# Altium schematic sheet 6502-Debugger_2020-04-26_19-41-25.schdoc
size 223 x 147 mm
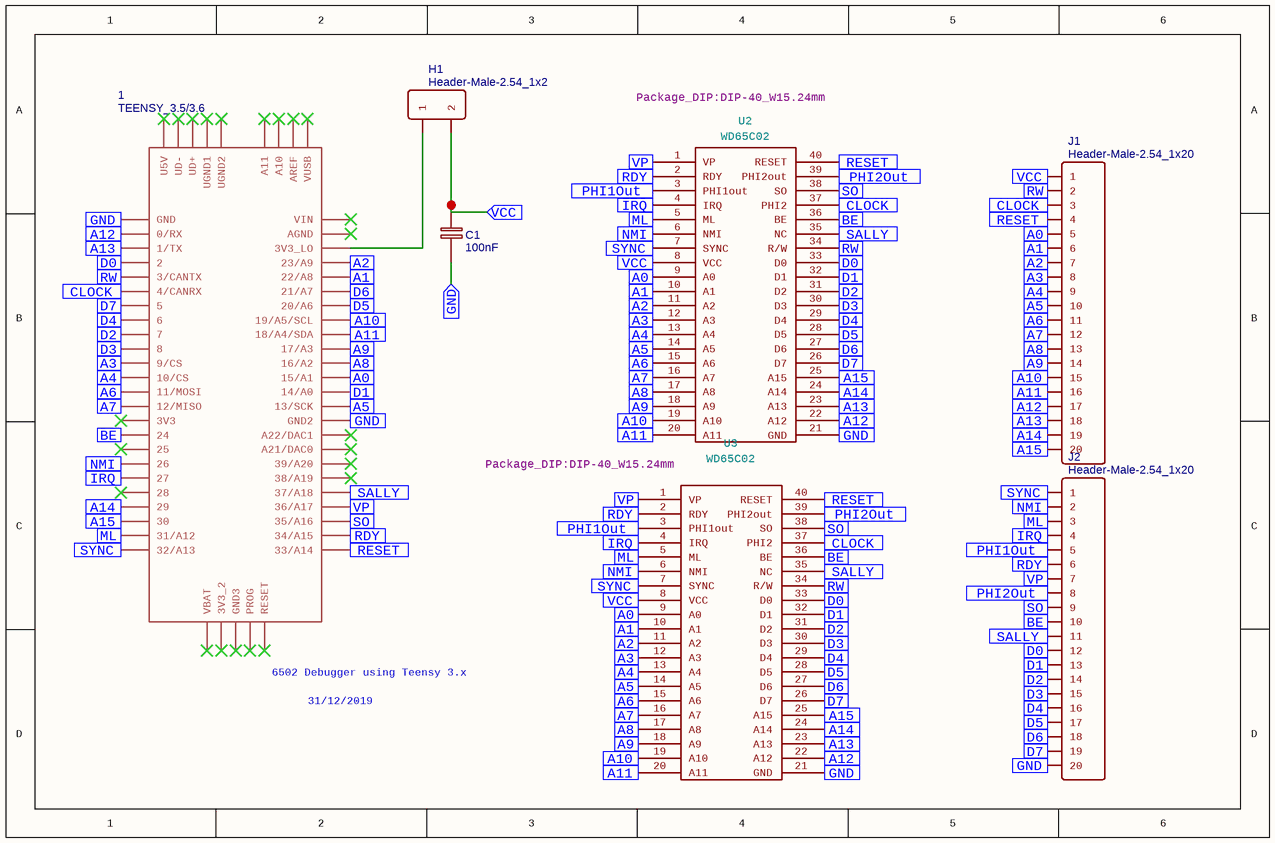
[diagram p0: 6502-Debugger_2020-04-26_19-41-25.schdoc]

## Parts
1  TEENSY_3.5/3.6  [TEENSY_3.5/3.6]
C1  100nF  [RAD-0.1]
H1  Header-Male-2.54_1x2  [HDR-2X1/2.54]
J1  Header-Male-2.54_1x20  [HDR-TH_20PIN-V-MALE-PITCH2.54]
J2  Header-Male-2.54_1x20  [HDR-TH_20PIN-V-MALE-PITCH2.54]
U2  WD65C02  [DIP-40_W15.24MM]
U3  WD65C02  [DIP-40_W15.24MM]

## Ports
A0 (in), A1 (in), A2 (in), A3 (in), A4 (in), A5 (in), A6 (in), A7 (in), A8 (in), A9 (in), A10 (in), A11 (in), A12 (in), A13 (in), A14 (in), A15 (in), BE (in), CLOCK (in), D0 (in), D1 (in), D2 (in), D3 (in), D4 (in), D5 (in), D6 (in), D7 (in), GND (in), IRQ (in), ML (in), NMI (in), PHI1Out (in), PHI2Out (in), RDY (in), RESET (in), RW (in), SALLY (in), SO (in), SYNC (in), VCC (in), VP (in)

## Nets
A0: 1.15/A1 J1.5 U2.9(A0) U3.9(A0) ; port A0
A1: 1.22/A8 J1.6 U2.10(A1) U3.10(A1) ; port A1
A2: 1.23/A9 J1.7 U2.11(A2) U3.11(A2) ; port A2
A3: 1.9/CS J1.8 U2.12(A3) U3.12(A3) ; port A3
A4: 1.10/CS J1.9 U2.13(A4) U3.13(A4) ; port A4
A5: 1.13/SCK J1.10 U2.14(A5) U3.14(A5) ; port A5
A6: 1.11/MOSI J1.11 U2.15(A6) U3.15(A6) ; port A6
A7: 1.12/MISO J1.12 U2.16(A7) U3.16(A7) ; port A7
A8: 1.16/A2 J1.13 U2.17(A8) U3.17(A8) ; port A8
A9: 1.17/A3 J1.14 U2.18(A9) U3.18(A9) ; port A9
A10: 1.19/A5/SCL J1.15 U2.19(A10) U3.19(A10) ; port A10
A11: 1.18/A4/SDA J1.16 U2.20(A11) U3.20(A11) ; port A11
A12: 1.0/RX J1.17 U2.22(A12) U3.22(A12) ; port A12
A13: 1.1/TX J1.18 U2.23(A13) U3.23(A13) ; port A13
A14: 1.29 J1.19 U2.24(A14) U3.24(A14) ; port A14
A15: 1.30 J1.20 U2.25(A15) U3.25(A15) ; port A15
BE: 1.24 J2.10 U2.36(BE) U3.36(BE) ; port BE
CLOCK: 1.4/CANRX J1.3 U2.37(PHI2) U3.37(PHI2) ; port CLOCK
D0: 1.2 J2.12 U2.33(D0) U3.33(D0) ; port D0
D1: 1.14/A0 J2.13 U2.32(D1) U3.32(D1) ; port D1
D2: 1.7 J2.14 U2.31(D2) U3.31(D2) ; port D2
D3: 1.8 J2.15 U2.30(D3) U3.30(D3) ; port D3
D4: 1.6 J2.16 U2.29(D4) U3.29(D4) ; port D4
D5: 1.20/A6 J2.17 U2.28(D5) U3.28(D5) ; port D5
D6: 1.21/A7 J2.18 U2.27(D6) U3.27(D6) ; port D6
D7: 1.5 J2.19 U2.26(D7) U3.26(D7) ; port D7
GND: 1.GND 1.GND2 C1.2 J2.20 U2.21(GND) U3.21(GND) ; port GND
IRQ: 1.27 J2.4 U2.4(IRQ) U3.4(IRQ) ; port IRQ
ML: 1.31/A12 J2.3 U2.5(ML) U3.5(ML) ; port ML
NMI: 1.26 J2.2 U2.6(NMI) U3.6(NMI) ; port NMI
PHI1Out: J2.5 U2.3(PHI1out) U3.3(PHI1out) ; port PHI1Out
PHI2Out: J2.8 U2.39(PHI2out) U3.39(PHI2out) ; port PHI2Out
RDY: 1.34/A15 J2.6 U2.2(RDY) U3.2(RDY) ; port RDY
RESET: 1.33/A14 J1.4 U2.40(RESET) U3.40(RESET) ; port RESET
RW: 1.3/CANTX J1.2 U2.34(R/W) U3.34(R/W) ; port RW
SALLY: 1.37/A18 J2.11 U2.35(NC) U3.35(NC) ; port SALLY
SO: 1.35/A16 J2.9 U2.38(SO) U3.38(SO) ; port SO
SYNC: 1.32/A13 J2.1 U2.7(SYNC) U3.7(SYNC) ; port SYNC
VCC: C1.1 H1.2 J1.1 U2.8(VCC) U3.8(VCC) ; port VCC
VP: 1.36/A17 J2.7 U2.1(VP) U3.1(VP) ; port VP
Net1_3V3_LO: 1.3V3_LO H1.1

Not connected (* = marked no-connect by the designer): 1 3V3* 3V3_2* 21/DAC0(A21/DAC0)* 25* 28* 38/A19* 39/A20* A10* A11* A22/DAC1* AGND* AREF* GND3* PROG* RESET* U5V* UD+* UD-* UGND1* UGND2* VBAT* VIN* VUSB*

## Notes on the sheet
- Package_DIP:DIP-40_W15.24mm
- (near 1) 6502 Debugger using Teensy 3.x
- 31/12/2019

## Library data of the parts
1 = TEENSY_3.5/3.6: Contributor: Nathan Myaz; spicePre: ?; spiceSymbolName: TEENSY_3.5/3.6
C1 = 100nF: nameAlias: Value(F); spicePre: C; spiceSymbolName: Cap_RAD-0.1_EU
H1 = Header-Male-2.54_1x2: BOM_Manufacturer: TE Connectivity; BOM_Manufacturer Part: 826629-2; BOM_Supplier: LCSC; image: //image.lceda.cn/szlcsc/C86471.jpg; BOM_Supplier Part: C86471; spicePre: H; spiceSymbolName: Header-Male-2.54_1x2
J1 J2 = Header-Male-2.54_1x20: BOM_Manufacturer: BOOMELE; BOM_Manufacturer Part: 2.54mm 1*20PHeader; BOM_Supplier: LCSC; image: //image.lceda.cn/szlcsc/C50981.jpg; BOM_Supplier Part: C50981; spicePre: J; spiceSymbolName: Header-Male-2.54_1x20